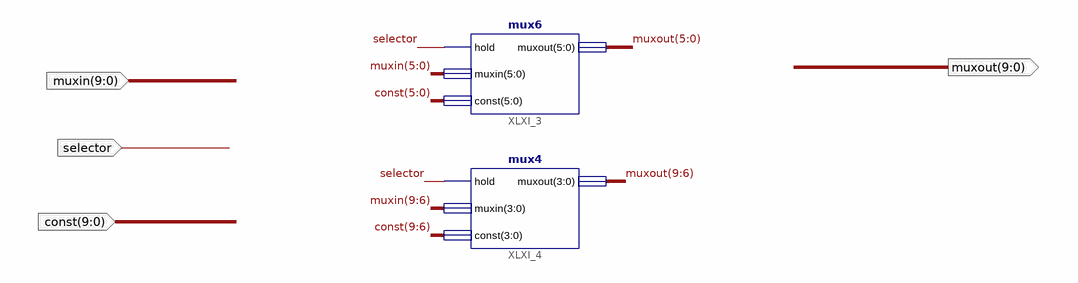
[diagram p0: schematic sheet 1]
// Xilinx ISE schematic mux10.sch (artix7) as structural Verilog: 2 symbols, 4 ports
module mux10 (
  input  [9:0] muxin,
  input  selector,
  input  [9:0] \const ,
  output [9:0] muxout
);

  mux6 XLXI_3 (.hold(selector), .muxin(muxin[5:0]), .\const (\const [5:0]), .muxout(muxout[5:0]));
  mux4 XLXI_4 (.hold(selector), .muxin(muxin[9:6]), .\const (\const [9:6]), .muxout(muxout[9:6]));
endmodule
